# EAGLE design amp_test (EAGLE 7.6.0)
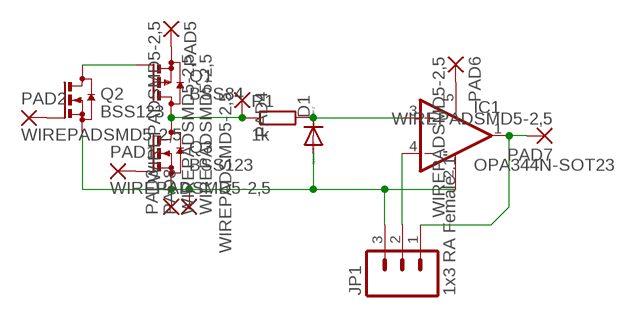
[diagram p0: schematic, sheet 1]

## Parts
D1  DIODE-SOD323-R  [SOD323-R]
IC1  OPA344N-SOT23  [SOT23-5]
JP1  1x3 RA Female .1"  M03SMD_RA_FEMALE  [1X03_SMD_RA_FEMALE]
PAD1  WIREPADSMD5-2,5  [5-2,5]
PAD2  WIREPADSMD5-2,5  [5-2,5]
PAD3  WIREPADSMD5-2,5  [5-2,5]
PAD4  WIREPADSMD5-2,5  [5-2,5]
PAD5  WIREPADSMD5-2,5  [5-2,5]
PAD6  WIREPADSMD5-2,5  [5-2,5]
PAD7  WIREPADSMD5-2,5  [5-2,5]
PAD8  WIREPADSMD5-2,5  [5-2,5]
Q1  BSS84  [SOT23]
Q2  BSS123  [SOT23]
Q3  BSS123  [SOT23]
R1  1k  R-EU_R0603  [R0603]

## Nets
N$1: PAD1.1(P) Q3.1(G)
N$2: PAD2.1(P) Q2.1(G)
N$3: D1.A IC1.2(V-) JP1.3 PAD3.1(P) PAD8.1(P) Q2.2(S) Q3.2(S)
N$4: PAD4.1(P) Q1.3(D) Q3.3(D) R1.1
N$5: D1.C IC1.3(+IN) R1.2
N$6: Q1.1(G) Q2.3(D)
N$7: PAD5.1(P) Q1.2(S)
N$8: IC1.5(V+) PAD6.1(P)
N$9: IC1.1(OUT) JP1.1 PAD7.1(P)
N$10: IC1.4(-IN) JP1.2

## Library data of the parts
D1 = diode:DIODE-: DIODE
IC1 = linear:OPA*-SOT23: Single Operational Amplifier Low Power, Single-Supply, Rail-To-Rail Operational Amplifier Source: http://focus.ti.com/lit/ds/symlink/opa2345.pdf
JP1 = SparkFun-Connectors:M03: Header 3 Standard 3-pin 0.1" header. Use with straight break away headers (SKU : PRT-00116), right angle break away headers (PRT-00553), swiss pins (PRT-00743), machine pins (PRT-00117), and female headers (PRT-00115). Molex polarized connector foot print use with SKU : PRT-08232 with associated crimp pins and housings.; PROD_ID: CONN-10926
PAD1-PAD8 = wirepad:WIREPAD: Wire PAD connect wire on PCB
Q1 = transistor-small-signal:BSS84: P-CHANNEL MOS FET
Q2 Q3 = transistor-small-signal:BSS123: N-CHANNEL MOS FET
R1 = rcl:R-EU_: RESISTOR, European symbol

## Net classes
0 default: width 0.635 mm

## Board
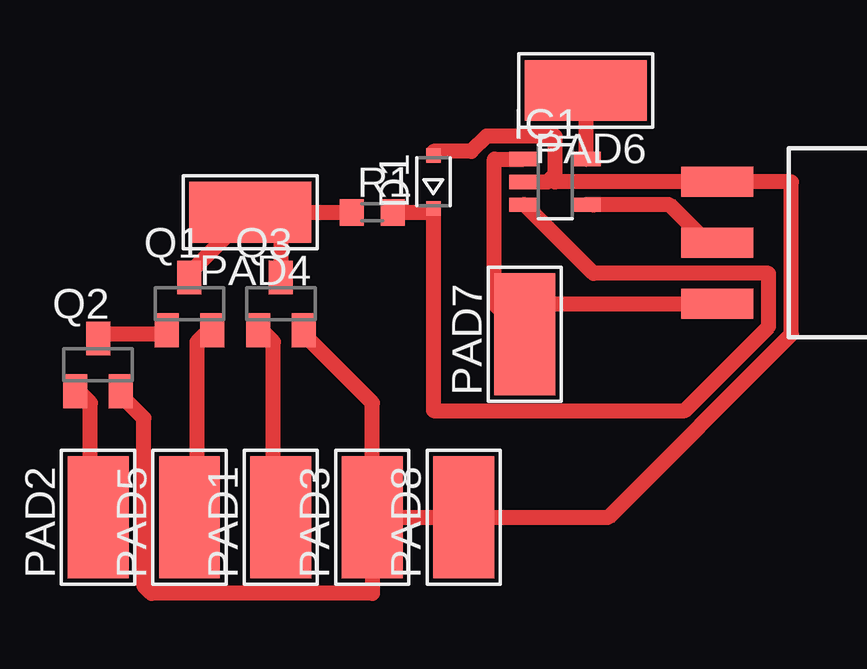
[diagram p1: board, top side]

No outline drawn. Coordinates in mm, seen from the top.
Copper layers (1*16): Top 0.035mm / dielectric 1.5mm / Bottom 0.035mm
Design rules "default": minimum track width 10mil, minimum drill 24mil, track to track 8mil, track to pad 8mil, pad to pad 8mil, via to via 8mil, smd to smd 8mil, copper to edge 40mil, drill to drill 8mil, minimum pad ring 10mil, minimum via ring 8mil, stop-mask expansion 4mil, vias tented up to drill 0mil, thermal gap 10mil

### Footprints (pad centres in the part's own frame; a part is rotated, then mirrored left to right if it is on the bottom)
SOD323-R = smd 0.6 x 0.6: A 1.1,0; C -1.1,0
SOT23-5 = smd 0.6 x 1.2: 1 -0.95,-1.306; 2 0,-1.306; 3 0.95,-1.306; 4 0.95,1.306; 5 -0.95,1.306
1X03_SMD_RA_FEMALE = smd 1.25 x 3: 1 -2.54,7.225; 2 0,7.225; 3 2.54,7.225
5-2,5 = smd 2.54 x 5.08: 1 0,0
SOT23 = smd 1 x 1.4: 1 -0.95,-1.1; 2 0.95,-1.1; 3 0,1.1
R0603 = smd 1 x 1.1: 1 -0.85,0; 2 0.85,0

### Placement (x,y rotation side)
D1  15.24,17.78 90 top
IC1  20.32,17.78 270 top
JP1  34.29,15.24 90 top
PAD1  8.89,3.81 0 top
PAD2  1.27,3.81 0 top
PAD3  12.7,3.81 0 top
PAD4  7.62,16.51 90 top
PAD5  5.08,3.81 0 top
PAD6  21.59,21.59 90 top
PAD7  19.05,11.43 0 top
PAD8  16.51,3.81 0 top
Q1  5.08,12.7 0 top
Q2  1.27,10.16 0 top
Q3  8.89,12.7 0 top
R1  12.7,16.51 0 top

### Tracks (layer width: path | path; a pad name or v marks a point on that pad's centre or on a via)
N$1
  Top 0.635: PAD1.1 8.57,4.13 8.57,11.11 8.26,11.43 Q3.1
N$2
  Top 0.635: PAD2.1 0.95,4.13 0.95,8.57 0.64,8.89 Q2.1
N$3
  Top 0.635: 20.16,17.94 20,17.78 IC1.2 | 20.16,17.94 20.32,18.1 20.32,19.68 17.46,19.68 16.83,19.05 15.24,19.05 D1.A | 20.16,17.94 20.32,17.78 JP1.3 30.16,17.78 30.16,11.43 22.54,3.81 PAD8.1 PAD3.1 | PAD3.1 12.7,0.64 3.49,0.64 3.17,0.95 3.17,7.94 2.22,8.89 Q2.2 | PAD3.1 12.7,8.57 9.84,11.43 Q3.2
N$4
  Top 0.635: 8.89,16.51 R1.1 | Q1.3 5.08,13.97 PAD4.1 8.89,16.51 | 8.89,16.51 Q3.3
N$5
  Top 0.635: R1.2 15.24,16.51 | 15.24,16.51 15.24,8.26 25.72,8.26 29.21,11.75 29.21,13.97 21.91,13.97 19.05,16.83 IC1.3 | 15.24,16.51 D1.C
N$6
  Top 0.635: Q2.3 1.27,11.43 4.13,11.43 Q1.1
N$7
  Top 0.635: PAD5.1 5.4,4.13 5.4,11.11 5.71,11.43 Q1.2
N$8
  Top 0.635: PAD6.1 21.59,18.73 IC1.5
N$9
  Top 0.635: IC1.1 18.73,18.73 17.78,18.73 17.78,12.7 PAD7.1 18.1,12.7 JP1.1
N$10
  Top 0.635: JP1.2 26.67,15.24 25.08,16.83 21.91,16.83 IC1.4